# EAGLE design Lux (EAGLE 7.7.0)
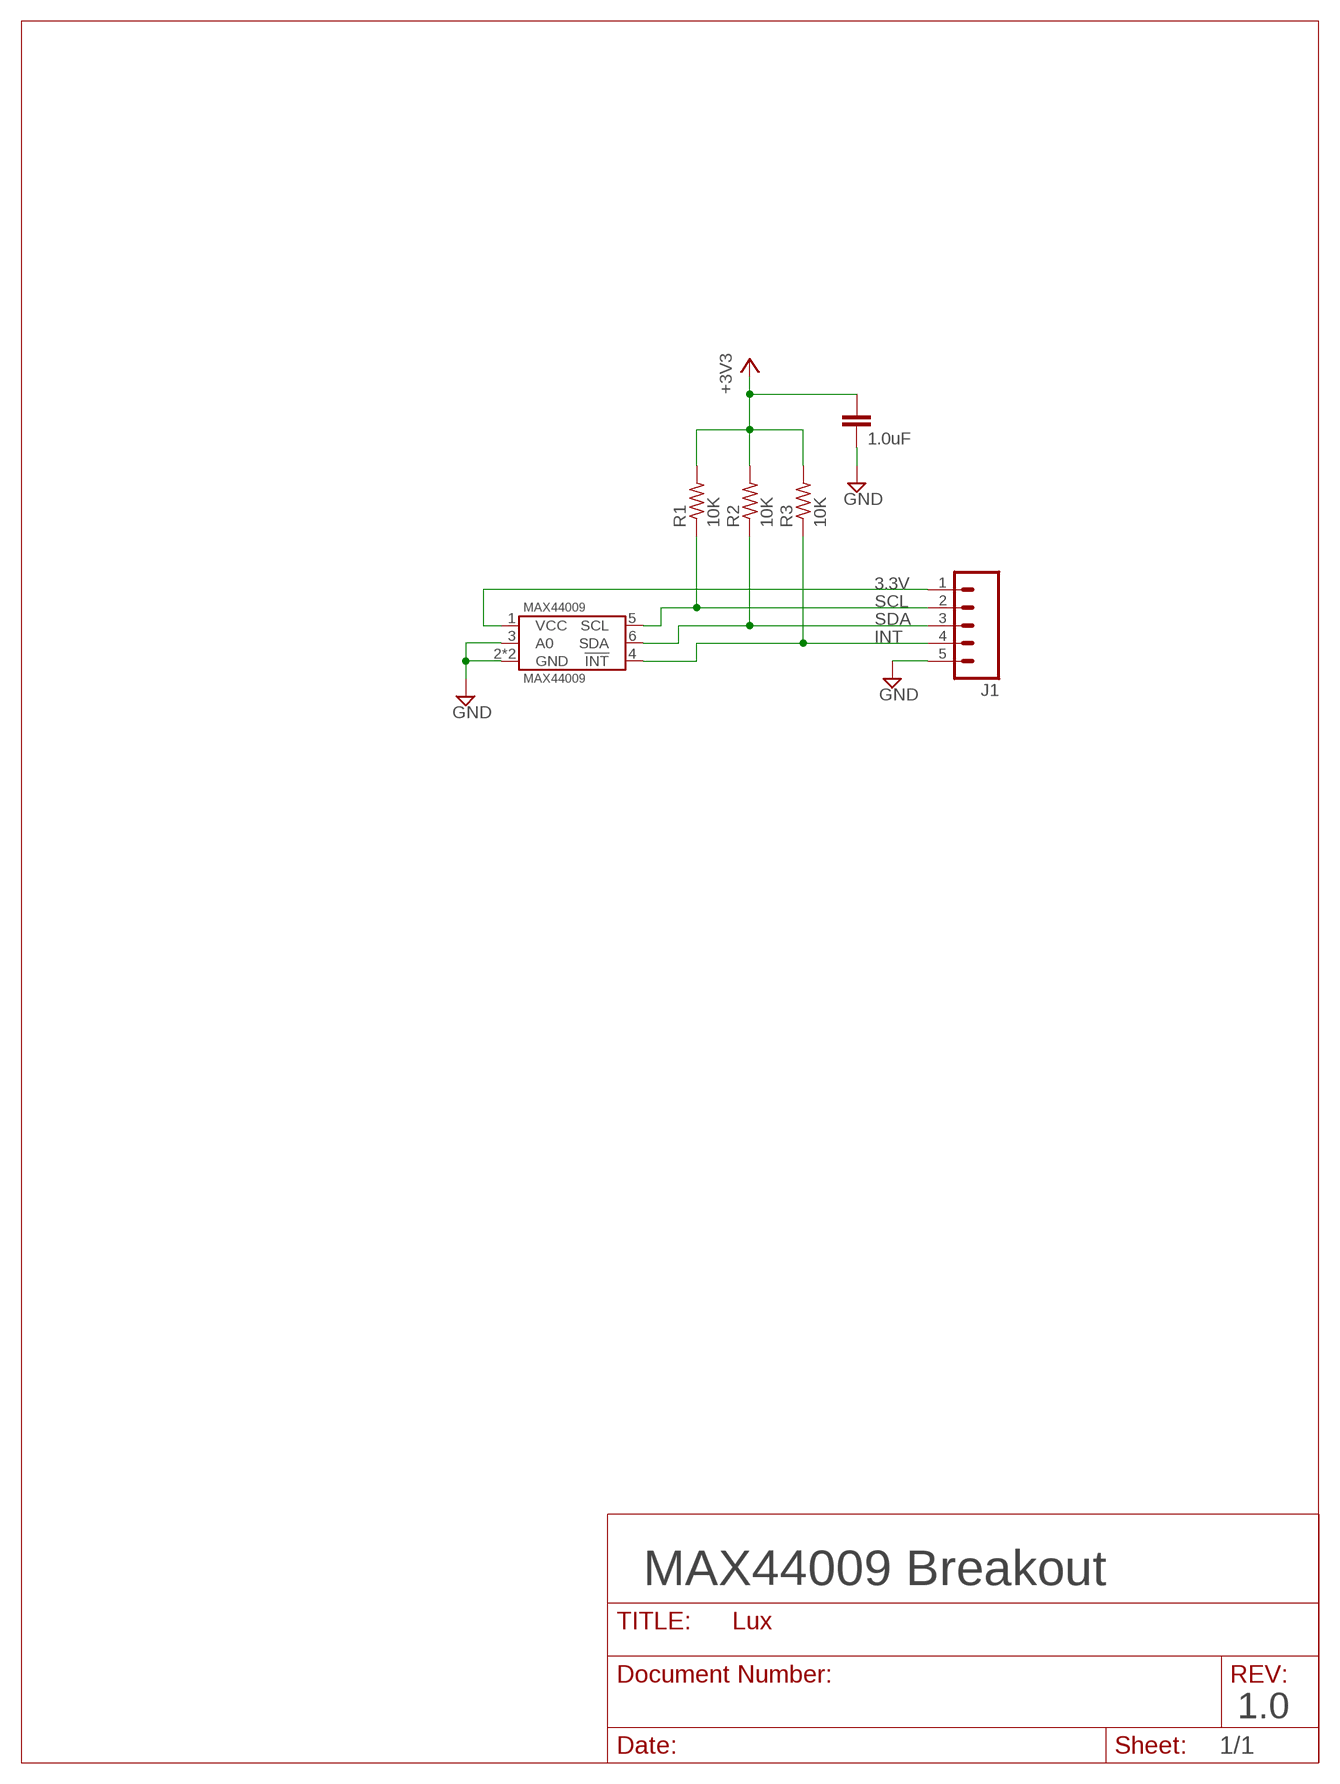
[diagram p0: schematic, sheet 1]

## Parts
CLOCK_BATT_DECOUP  1.0uF  C-EUC0603  [C0603]
J1  M05NO_SILK  [1X05_NO_SILK]
MAX44009  MAX44009  [MAX44009]
R1  10K  R-US_R0603  [R0603]
R2  10K  R-US_R0603  [R0603]
R3  10K  R-US_R0603  [R0603]

## Nets
3.3V: CLOCK_BATT_DECOUP.1 J1.1 MAX44009.1(VCC) R1.2 R2.2 R3.2 ; supply symbol labelled +3V3
GND: CLOCK_BATT_DECOUP.2 J1.5 MAX44009.2(GND) MAX44009.3(A0) MAX44009.PAD(GND)
INT: J1.4 MAX44009.4(!INT) R3.1
SCL: J1.2 MAX44009.5(SCL) R1.1
SDA: J1.3 MAX44009.6(SDA) R2.1

## Notes on the sheet
- MAX44009 Breakout
- 1.0
- 1/1

## Library data of the parts
CLOCK_BATT_DECOUP = rcl:C-EU: CAPACITOR, European symbol
J1 = SparkFun-Connectors:M05: Header 5 Standard 5-pin 0.1" header. Use with straight break away headers (SKU : PRT-00116), right angle break away headers (PRT-00553), swiss pins (PRT-00743), machine pins (PRT-00117), and female headers (PRT-00115). Molex polarized connector foot print use with SKU : PRT-08230 with associated crimp pins and housings.
MAX44009 = Maxim:MAX44009: Ambient Light Sensor
R1-R3 = resistor:R-US_: RESISTOR, American symbol

## Net classes
0 default: width 0.203 mm, drill 0.305 mm
1 power: width 0.254 mm

## Board
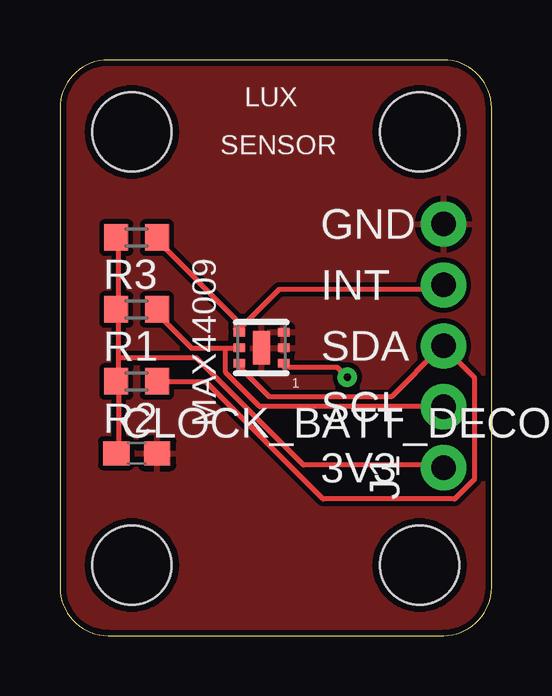
[diagram p1: board, top side]
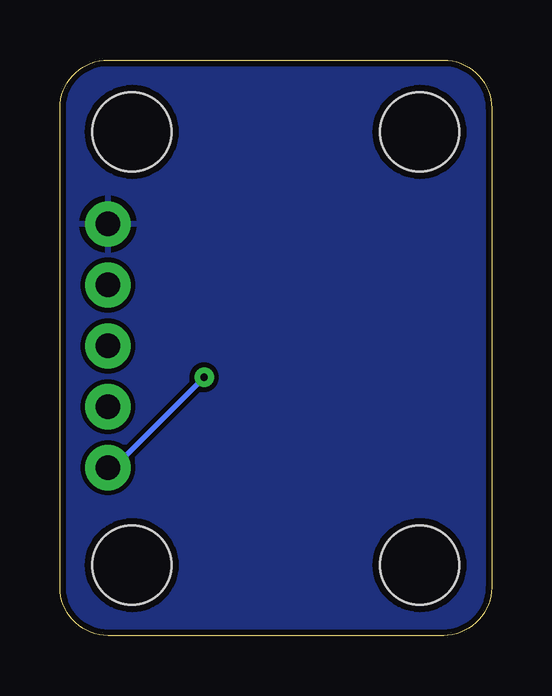
[diagram p2: board, bottom side, seen from below]

Size 18 x 24 mm. Coordinates in mm from the lower left corner, seen from the top.
Outline: 18,22 arc90 16,24 2,24 arc90 0,22 0,2 arc90 2,0 16,0 arc90 18,2 18,22
Copper layers (1*16): Top 0.035mm / dielectric 1.5mm / Bottom 0.035mm
Design rules "SparkFun *": minimum track width 8mil, minimum drill 12mil, track to track 8mil, track to pad 8mil, pad to pad 8mil, via to via 8mil, smd to smd 8mil, copper to edge 10mil, drill to drill 8mil, minimum pad ring 12mil, minimum via ring 10mil, stop-mask expansion 4mil, vias tented up to drill 25mil, thermal gap 10mil

### Footprints (pad centres in the part's own frame; a part is rotated, then mirrored left to right if it is on the bottom)
C0603 = smd 1.1 x 1: 1 -0.85,0; 2 0.85,0
1X05_NO_SILK = drill 1.016 pad 1.88: 1 0,0; 2 2.54,0; 3 5.08,0; 4 7.62,0; 5 10.16,0
STAND-OFF = hole 3.302: 0,0
MAX44009 = smd 0.48 x 0.36: 1 -0.925,0.65; 2 -0.925,0; 3 -0.925,-0.65; 4 0.925,-0.65; 5 0.925,0; 6 0.925,0.65 | smd 0.71 x 1.4: PAD 0,0
R0603 = smd 1 x 1.1: 1 -0.85,0; 2 0.85,0

### Placement (x,y rotation side)
CLOCK_BATT_DECOUP  3.2,7.6 0 top
J1  16,7 90 top
JP1  STAND-OFF  [STAND-OFF]  3,21 0 top
JP2  STAND-OFF  [STAND-OFF]  15,21 0 top
JP3  STAND-OFF  [STAND-OFF]  15,2.94 0 top
JP4  STAND-OFF  [STAND-OFF]  3,2.94 0 top
MAX44009  8.4,12 180 top
R1  3.2,13.6 180 top
R2  3.2,10.6 180 top
R3  3.2,16.6 180 top

### Tracks (layer width: path | path; a pad name or v marks a point on that pad's centre or on a via)
3.3V  (via drill 0.3)
  Top 0.203: CLOCK_BATT_DECOUP.1 2.44,7.72 2.44,10.57 R2.2 2.44,10.77 2.44,11.58 | 2.44,11.58 2.44,13.41 R1.2 2.44,13.61 2.44,16.46 R3.2 | v11.99,10.77 11.58,11.18 9.35,11.18 MAX44009.1 | 2.44,11.58 5.69,11.58 10.16,7.11 15.85,7.11 J1.1
  Bottom 0.203: v11.99,10.77 15.85,6.91 J1.1
GND
  pour Bottom: -1.27,78.74 -1.27,-1.27 54.61,-1.27 54.61,78.74
  pour Top: -1.27,78.74 -1.27,-1.27 54.61,-1.27 54.61,78.74
INT
  Top 0.203: R3.1 4.06,16.46 7.32,13.21 7.32,12.8 MAX44009.4 7.52,12.8 9.14,14.43 15.85,14.43 J1.4
SCL
  Top 0.203: 6.91,11.99 5.49,11.99 4.06,13.41 R1.1 | 6.91,11.99 7.32,11.99 MAX44009.5 | 6.91,11.99 6.91,10.97 8.33,9.55 15.85,9.55 J1.2
SDA
  Top 0.203: MAX44009.6 7.52,11.18 8.74,9.96 13.82,9.96 15.85,11.99 J1.3 16.05,11.99 17.27,10.77 17.27,6.5 16.46,5.69 10.97,5.69 6.1,10.57 4.06,10.57 R2.1

### Text on the board
tPlace: LUX | SENSOR | GND | INT | SDA | 1 | SCL | 3V3